# EAGLE design EasyFlash 1.4.1 REV B (EAGLE 5.05)
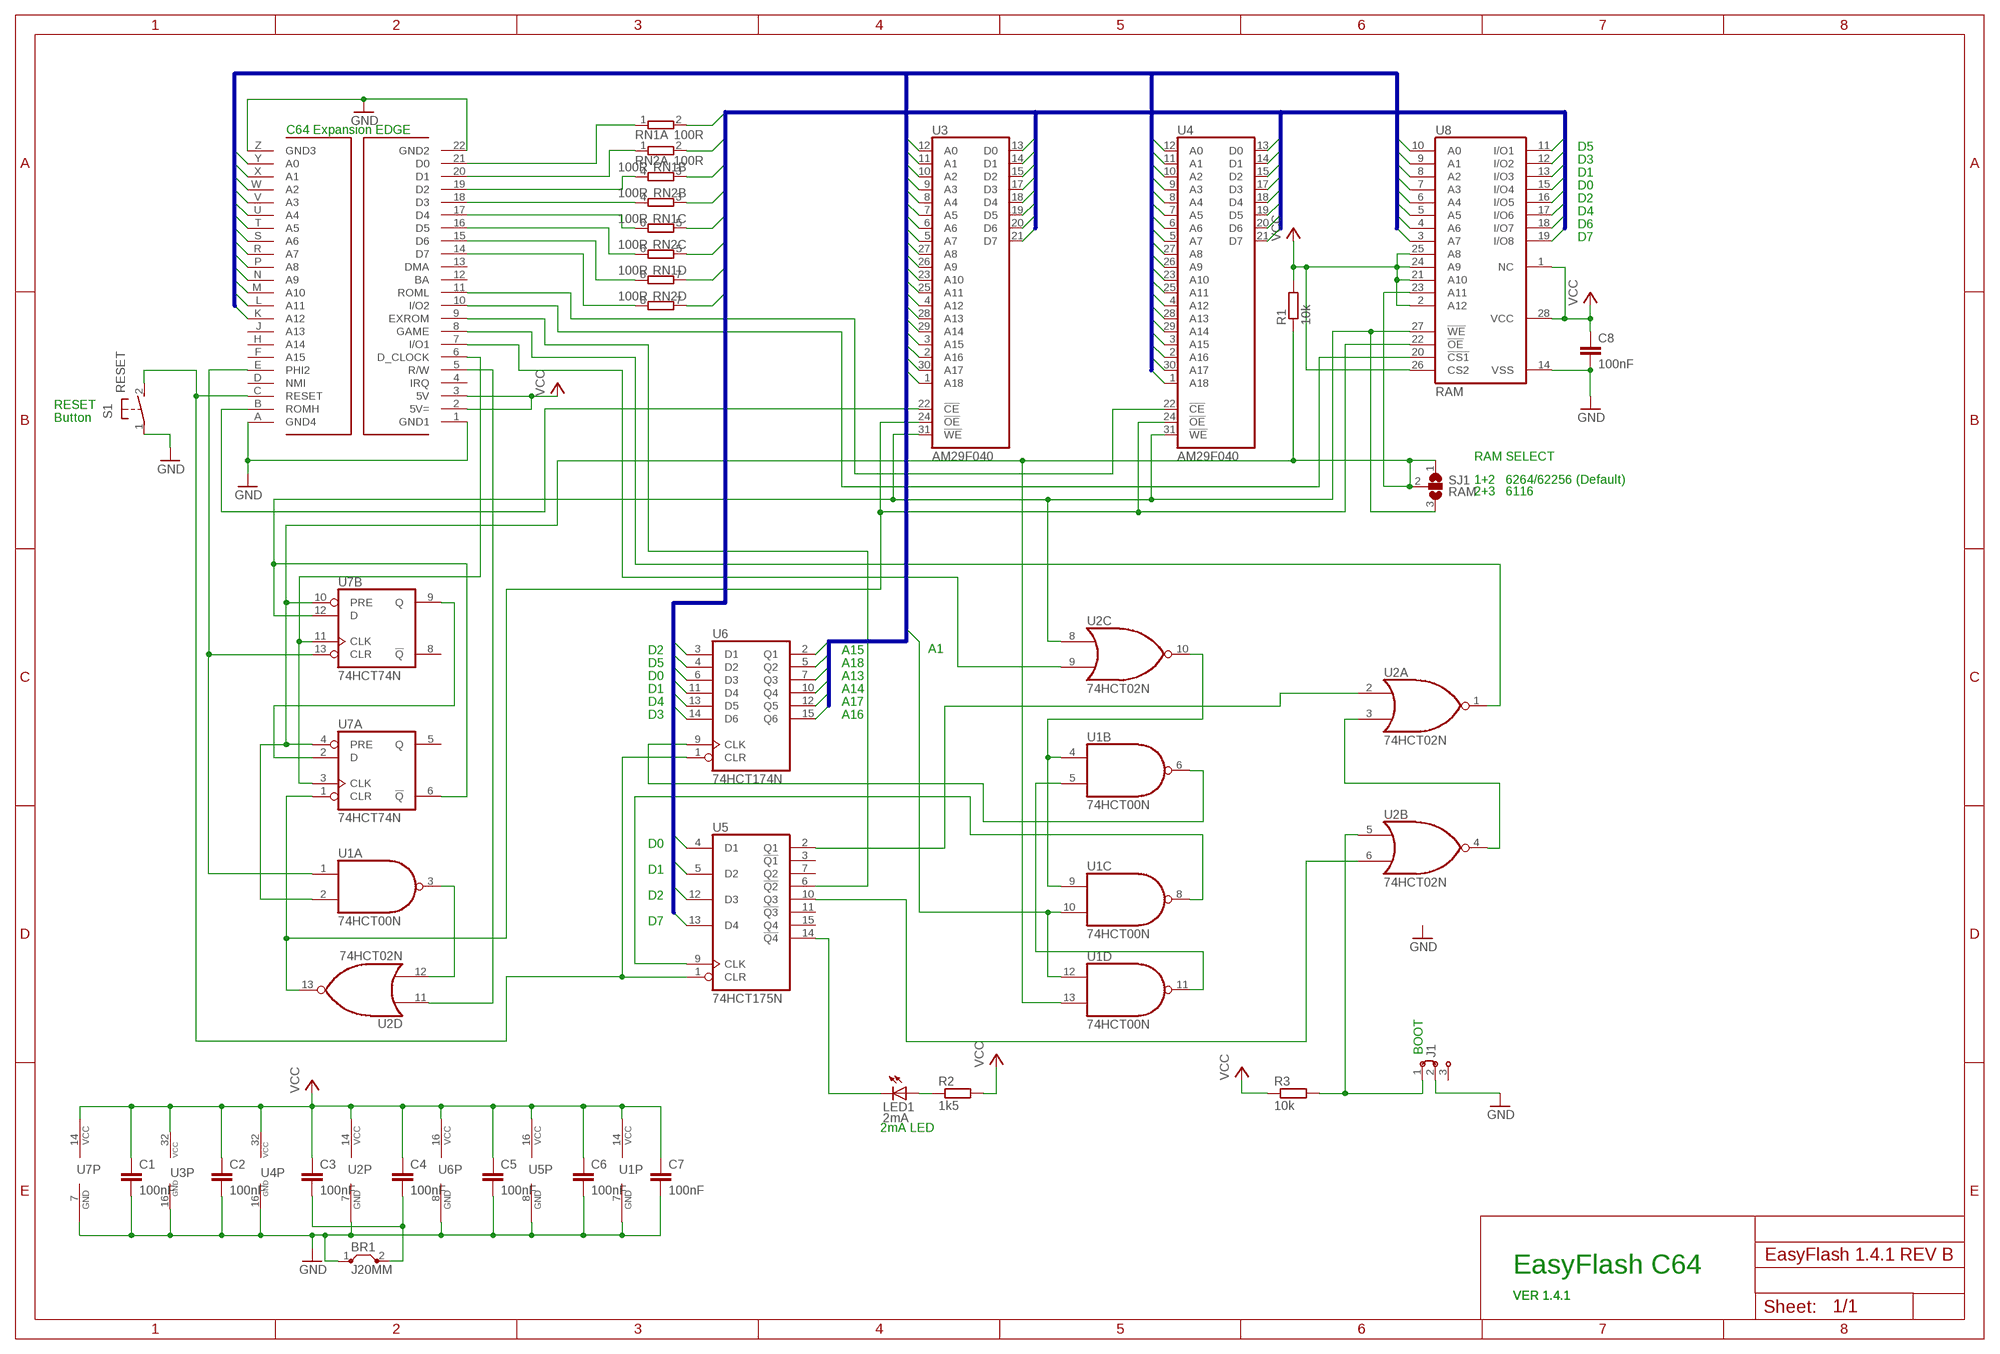
[diagram p0: schematic, sheet 1]

## Parts
BR1  J20MM  [20]
C1  100nF  C-EU050-025X075  [C050-025X075]
C2  100nF  C-EU050-025X075  [C050-025X075]
C3  100nF  C-EU050-025X075  [C050-025X075]
C4  100nF  C-EU050-025X075  [C050-025X075]
C5  100nF  C-EU050-025X075  [C050-025X075]
C6  100nF  C-EU050-025X075  [C050-025X075]
C7  100nF  C-EU050-025X075  [C050-025X075]
C8  100nF  C-EU050-025X075  [C050-025X075]
CN1  EP64  CARTRIDGE  [CARTRIDGE]
J1  J2X3MM  [03C]
LED1  2mA  LED3MM  [LED3MM]
R1  10k  R-EU_0207/10  [0207/10]
R2  1k5  R-EU_0207/10  [0207/10]
R3  10k  R-EU_0207/10  [0207/10]
RN1  100R  E4R  [SIL8]
RN2  100R  E4R  [SIL8]
S1  RESET  31-XX  [B3F-31XX]
SJ1  RAM  SJ2WW  [SJ_2W]
U1  74HCT00N  74LS00N  [DIL14]
U2  74HCT02N  74LS02N  [DIL14]
U3  AM29F040  AM29F040JPLCC_DIL  [PLCC-SR32]
U4  AM29F040  AM29F040JPLCC_DIL  [PLCC-SR32]
U5  74HCT175N  74LS175N  [DIL16]
U6  74HCT174N  74LS174N  [DIL16]
U7  74HCT74N  74LS74N  [DIL14]
U8  RAM  6264A  [DIL28-6]

## Nets
/OE: U2.13(D:O) U3.24(!OE) U4.24(!OE) U7.1(A:CLR) U8.22(!OE)
/WE: SJ1.3 U2.8(C:I0) U3.31(!WE) U4.31(!WE) U7.6(A:!Q) U7.12(B:D) U8.27(!WE)
A0: CN1.Y(A0) U3.12(A0) U4.12(A0) U8.10(A0)
A1: CN1.X(A1) U1.10(C:I1) U1.12(D:I0) U3.11(A1) U4.11(A1) U8.9(A1)
A2: CN1.W(A2) U3.10(A2) U4.10(A2) U8.8(A2)
A3: CN1.V(A3) U3.9(A3) U4.9(A3) U8.7(A3)
A4: CN1.U(A4) U3.8(A4) U4.8(A4) U8.6(A4)
A5: CN1.T(A5) U3.7(A5) U4.7(A5) U8.5(A5)
A6: CN1.S(A6) U3.6(A6) U4.6(A6) U8.4(A6)
A7: CN1.R(A7) U3.5(A7) U4.5(A7) U8.3(A7)
A8: CN1.P(A8) U3.27(A8) U4.27(A8)
A9: CN1.N(A9) U3.26(A9) U4.26(A9)
A10: CN1.M(A10) U3.23(A10) U4.23(A10)
A11: CN1.L(A11) U3.25(A11) U4.25(A11)
A12: CN1.K(A12) U3.4(A12) U4.4(A12)
A13: U3.28(A13) U4.28(A13) U6.7(Q3)
A14: U3.29(A14) U4.29(A14) U6.10(Q4)
A15: U3.3(A15) U4.3(A15) U6.2(Q1)
A16: U3.2(A16) U4.2(A16) U6.15(Q6)
A17: U3.30(A17) U4.30(A17) U6.12(Q5)
A18: U3.1(A18) U4.1(A18) U6.5(Q2)
D0: RN1.2 U3.13(D0) U4.13(D0) U5.4(D1) U6.6(D3) U8.15(I/O4)
D1: RN2.2 U3.14(D1) U4.14(D1) U5.5(D2) U6.11(D4) U8.13(I/O3)
D2: RN1.3 U3.15(D2) U4.15(D2) U5.12(D3) U6.3(D1) U8.16(I/O5)
D3: RN2.3 U3.17(D3) U4.17(D3) U6.14(D6) U8.12(I/O2)
D4: RN1.5 U3.18(D4) U4.18(D4) U6.13(D5) U8.17(I/O6)
D5: RN2.5 U3.19(D5) U4.19(D5) U6.4(D2) U8.11(I/O1)
D6: RN1.7 U3.20(D6) U4.20(D6) U8.18(I/O7)
D7: RN2.7 U3.21(D7) U4.21(D7) U5.13(D4) U8.19(I/O8)
DOTCLK: CN1.6(D_CLOCK) U7.3(A:CLK) U7.11(B:CLK)
EXROM: CN1.9(EXROM) U5.6(!Q2)
GAME: CN1.8(GAME) U2.1(A:O)
GND: BR1.1 C1.2 C2.2 C5.2 C6.2 C7.2 C8.2 CN1.1(GND1) CN1.22(GND2) CN1.A(GND4) CN1.Z(GND3) J1.2 S1.1(P) U1.7(P:GND) U2.7(P:GND) U3.16(GND) U4.16(GND) U5.8(GND) U6.8(GND) U7.7(P:GND) U8.14(VSS)
I/O1: CN1.7(I/O1) U2.9(C:I1)
I/O2: CN1.10(I/O2) U8.20(!CS1)
N$1: U2.3(A:I1) U2.4(B:O)
N$2: CN1.21(D0) RN1.1
N$3: CN1.20(D1) RN2.1
N$4: CN1.19(D2) RN1.4
N$5: CN1.18(D3) RN2.4
N$6: CN1.17(D4) RN1.6
N$7: CN1.16(D5) RN2.6
N$8: CN1.15(D6) RN1.8
N$9: CN1.14(D7) RN2.8
N$11: U1.4(B:I0) U1.9(C:I0) U2.10(C:O)
N$14: U7.2(A:D) U7.9(B:Q)
N$15: U1.5(B:I1) U1.11(D:O)
N$16: LED1.A R2.1
N$17: J1.1 R3.2 U2.5(B:I0)
N$18: LED1.K(C) U5.14(!Q4)
N$21: U1.3(A:O) U2.12(D:I1)
N$30: U1.6(B:O) U6.9(CLK)
N$31: U1.8(C:O) U5.9(CLK)
N$32: U2.2(A:I0) U5.2(Q1)
N$33: U2.6(B:I1) U5.10(Q3)
N$34: BR1.2 C3.2 C4.2
PHI2: CN1.E(PHI2) U1.1(A:I0) U7.13(B:CLR)
PULLUP: R1.1 SJ1.1 SJ1.2 U1.2(A:I1) U1.13(D:I1) U7.4(A:PRE) U7.10(B:PRE) U8.23(A11)
R/W: CN1.5(R/W) U2.11(D:I0)
RESET: CN1.C(RESET) S1.2(S) U5.1(CLR) U6.1(CLR)
ROMH: CN1.B(ROMH) U3.22(!CE)
ROML: CN1.11(ROML) U4.22(!CE)
VCC: C1.1 C2.1 C3.1 C4.1 C5.1 C6.1 C7.1 C8.1 CN1.2(5V=) CN1.3(5V) R1.2 R2.2 R3.1 U1.14(P:VCC) U2.14(P:VCC) U3.32(VCC) U4.32(VCC) U5.16(VCC) U6.16(VCC) U7.14(P:VCC) U8.1(NC) U8.2(A12) U8.21(A10) U8.24(A9) U8.25(A8) U8.26(CS2) U8.28(VCC)
Unconnected: CN1.4(IRQ) CN1.12(BA) CN1.13(DMA) CN1.D(NMI) CN1.F(A15) CN1.H(A14) CN1.J(A13) J1.3 U5.3(!Q1) U5.7(Q2) U5.11(!Q3) U5.15(Q4) U7.5(A:Q) U7.8(B:!Q)

## Buses
D[0..7]
A[0..18]

## Notes on the sheet
- C64 Expansion EDGE
- D5
- D3
- D1
- D0
- D2
- D4
- D6
- D7
- RESET
- Button
- RAM SELECT
- 1+2   6264/62256 (Default)
- 2+3   6116
- D2 | A15 | A1
- D5 | A18
- D0 | A13
- D1 | A14
- D4 | A17
- D3 | A16
- D0
- D1
- D2
- D7
- BOOT
- 2mA LED
- EasyFlash C64
- VER 1.4.1 | VER 1.4.1

## Library data of the parts
BR1 = jumper:J: Bridge
C1-C8 = rcl:C-EU: CAPACITOR, European symbol
CN1 = C64_EXPANSION_:CARTRIDGE
J1 = jumper:J2: Jumper switch 2 x 2.5 mm
LED1 = led:LED: LED OSRAM: - CHIPLED LG R971, LG N971, LY N971, LG Q971, LY Q971, LO R971, LY R971 LH N974, LH R974 LS Q976, LO Q976, LY Q976 LO Q996 - Hyper CHIPLED LW Q18S LB Q993, LB Q99A, LB R99A - SideLED LS A670, LO A670, LY A670, LG A670, LP A670 LB A673, LV A673, LT A673, LW A673 LH A674 LY A675 LS A676, LA A676, LO A676, LY A676, LW A676 LS A679, LY A679, LG A679 - Hyper Micro SIDELED® LS Y876, LA Y876, LO Y876, LY Y876 LT Y87S - SmartLED LW L88C, LW L88S LB L89C, LB L89S, LG L890 LS L89K, LO L89K, LY L89K LS L896, LA L896, LO L896, LY L896 - TOPLED LS T670, LO T670, LY T670, LG T670, LP T670 LSG T670, LSP T670, LSY T670, LOP T670, LYG T670 LG T671, LOG T671, LSG T671 LB T673, LV T673, LT T673, LW T673 LH T674 LS T676, LA T676, LO T676, LY T676, LB T676, LH T676, LSB T676, LW T676 LB T67C, LV T67C, LT T67C, LS T67K, LO T67K, LY T67K, LW E67C LS E67B, LA E67B, LO E67B, LY E67B, LB E67C, LV E67C, LT E67C LW T67C LS T679, LY T679, LG T679 LS T770, LO T770, LY T770, LG T770, LP T770 LB T773, LV T773, LT T773, LW T773 LH T774 LS E675, LA E675, LY E675, LS T675 LS T776, LA T776, LO T776, LY T776, LB T776 LHGB T686 LT T68C, LB T68C - Hyper Mini TOPLED® LB M676 - Mini TOPLED Santana® LG M470 LS M47K, LO M47K, LY M47K Source: http://www.osram.convergy.de LUXEON: - LUMILED® LXK2-PW12-R00, LXK2-PW12-S00, LXK2-PW14-U00, LXK2-PW14-V00 LXK2-PM12-R00, LXK2-PM12-S00, LXK2-PM14-U00 LXK2-PE12-Q00, LXK2-PE12-R00, LXK2-PE12-S00, LXK2-PE14-T00, LXK2-PE14-U00 LXK2-PB12-K00, LXK2-PB12-L00, LXK2-PB12-M00, LXK2-PB14-N00, LXK2-PB14-P00, LXK2-PB14-Q00 LXK2-PR12-L00, LXK2-PR12-M00, LXK2-PR14-Q00, LXK2-PR14-R00 LXK2-PD12-Q00, LXK2-PD12-R00, LXK2-PD12-S00 LXK2-PH12-R00, LXK2-PH12-S00 LXK2-PL12-P00, LXK2-PL12-Q00, LXK2-PL12-R00 Source: www.luxeon.com KINGBRIGHT: KA-3528ASYC Source: www.kingbright.com
R1-R3 = rcl:R-EU_: RESISTOR, European symbol
RN1 RN2 = resistor-sil:E4R: SIL RESISTOR
S1 = switch-omron:31-XX: OMRON SWITCH
SJ1 = jumper:SJ2W: SMD solder JUMPER
U1 = 74xx-us:74*00: Quad 2-input NAND gate
U2 = 74xx-us:74*02: Quad 2-input NOR gate
U3 U4 = am29-memory:AM29F040J: 4-Megabit FLASH MEMORY (512 K x 8 bit) 5 V-only
U5 = 74xx-us:74*175: Qadruple D type FLIP FLOP, clear
U6 = 74xx-us:74*174: Hex D type FLIP FLOP, clear
U7 = 74xx-us:74*74: Dual D type positive edge triggered FLIP FLOP, preset and clear
U8 = memory-hitachi:6264A: MEMORY

## Board
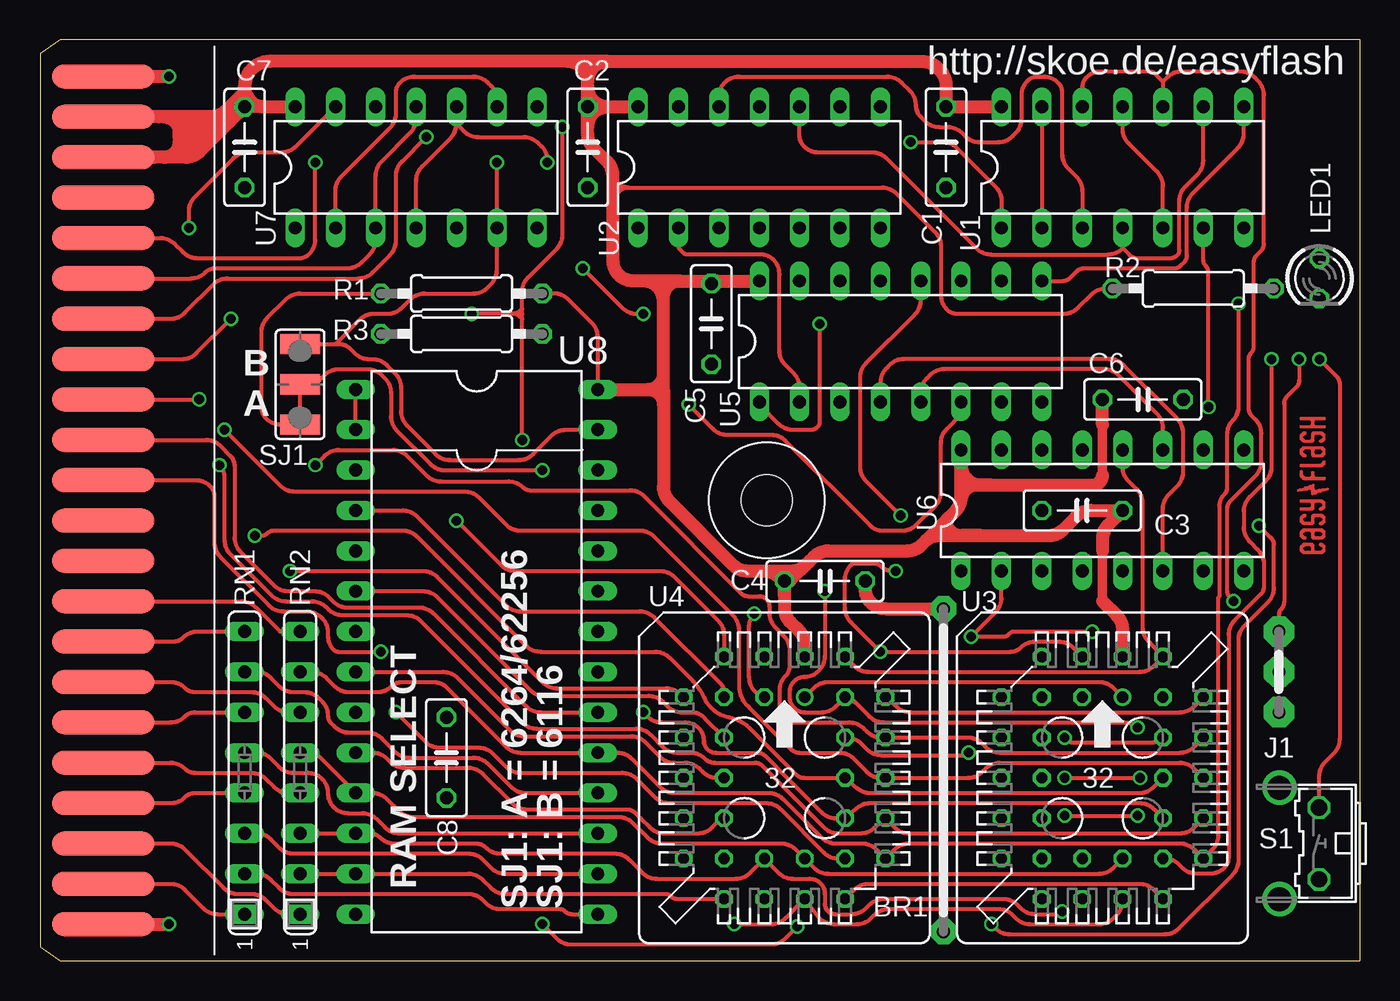
[diagram p1: board, top side]
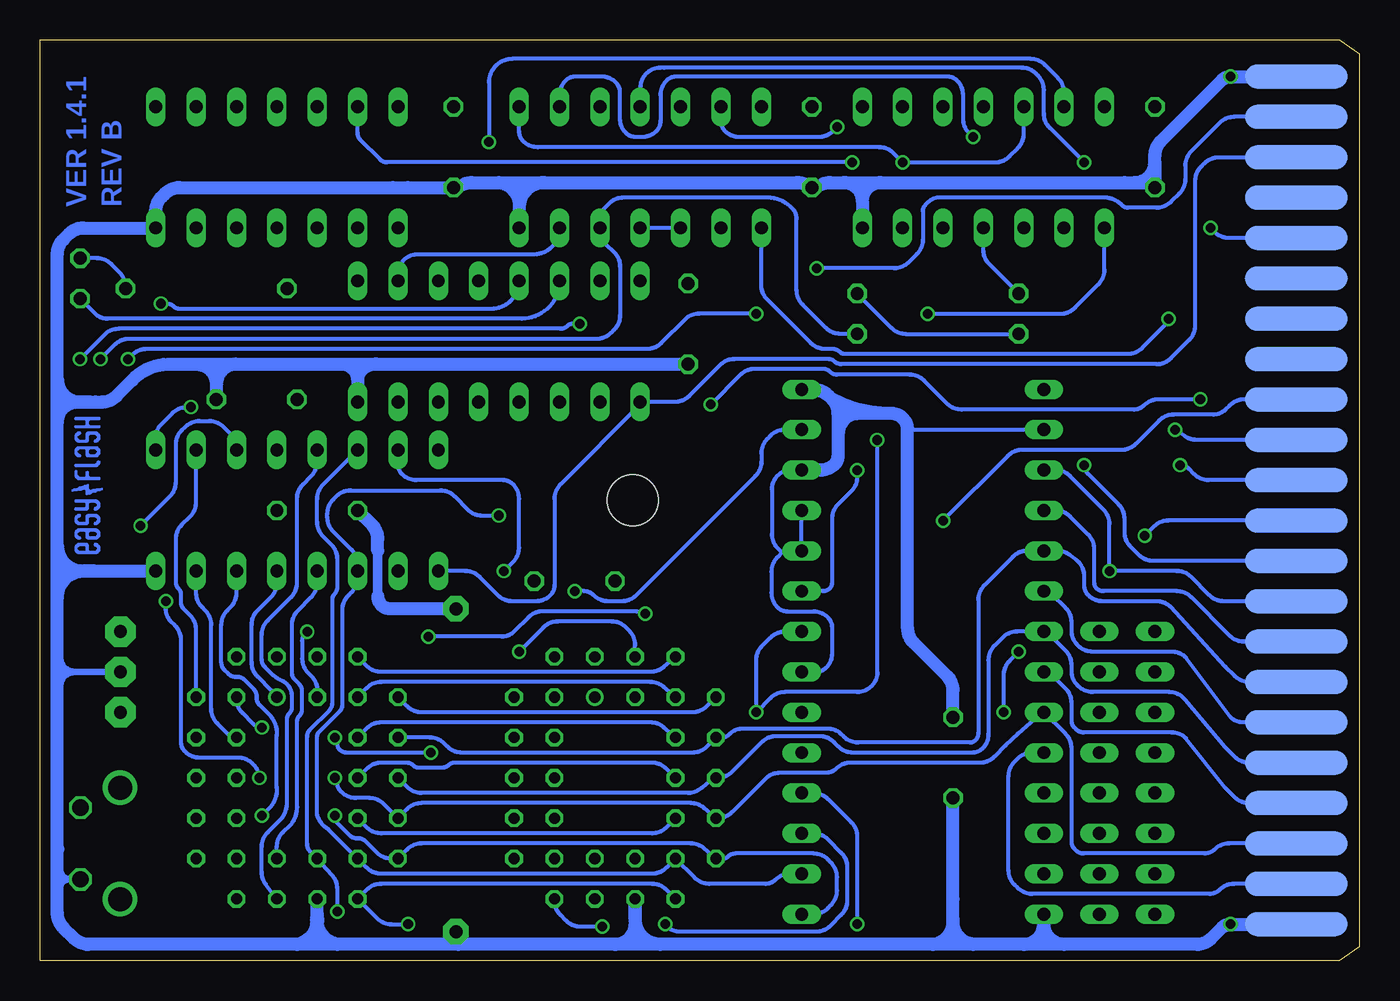
[diagram p2: board, bottom side, seen from below]

Size 83.03 x 57.98 mm. Coordinates in mm from the lower left corner, seen from the top.
Copper layers (1*16): Top 0.035mm / dielectric 1.5mm / Bottom 0.035mm
Design rules "PCB-POOL": minimum track width 6mil, minimum drill 12mil, track to track 6mil, track to pad 6mil, pad to pad 6mil, via to via 6mil, smd to smd 6mil, copper to edge 20mil, drill to drill 8mil, minimum pad ring 8mil, minimum via ring 6mil, stop-mask expansion 3mil, vias tented up to drill 0mil, thermal gap 8mil

### Footprints (pad centres in the part's own frame; a part is rotated, then mirrored left to right if it is on the bottom)
20 = drill 0.813 pad 1.6 octagon: 1 -10.16,0; 2 10.16,0
C050-025X075 = drill 0.813 octagon: 1 -2.54,0; 2 2.54,0
CARTRIDGE = smd 1.524 x 6.477: 1 -52.07,-24.13; 2 -49.53,-24.13; 3 -46.99,-24.13; 4 -44.45,-24.13; 5 -41.91,-24.13; 6 -39.37,-24.13; 7 -36.83,-24.13; 8 -34.29,-24.13; 9 -31.75,-24.13; 10 -29.21,-24.13; 11 -26.67,-24.13; 12 -24.13,-24.13; 13 -21.59,-24.13; 14 -19.05,-24.13; 15 -16.51,-24.13; 16 -13.97,-24.13; 17 -11.43,-24.13; 18 -8.89,-24.13; 19 -6.35,-24.13; 20 -3.81,-24.13; 21 -1.27,-24.13; 22 1.27,-24.13 | smd 1.524 x 6.477 bottom: A -52.07,-24.13; B -49.53,-24.13; C -46.99,-24.13; D -44.45,-24.13; E -41.91,-24.13; F -39.37,-24.13; H -36.83,-24.13; J -34.29,-24.13; K -31.75,-24.13; L -29.21,-24.13; M -26.67,-24.13; N -24.13,-24.13; P -21.59,-24.13; R -19.05,-24.13; S -16.51,-24.13; T -13.97,-24.13; U -11.43,-24.13; V -8.89,-24.13; W -6.35,-24.13; X -3.81,-24.13; Y -1.27,-24.13; Z 1.27,-24.13 | hole 3.2: -25.4,17.621
03C = drill 0.813 pad 1.905 octagon: 1 0,0; 2 2.54,0; 3 5.08,0
LED3MM = drill 0.813 octagon: A -1.27,0; K 1.27,0
0207/10 = drill 0.813 octagon: 1 -5.08,0; 2 5.08,0
SIL8 = drill 0.813 long: 1 -8.89,0; 2 -6.35,0; 3 -3.81,0; 4 -1.27,0; 5 1.27,0; 6 3.81,0; 7 6.35,0; 8 8.89,0
B3F-31XX = drill 1.016 octagon: 1 -2.261,-1.245; 2 2.261,-1.245 | drill 1.499 pad 2.159 round: 3 -3.505,1.245; 4 3.505,1.245
SJ_2W = smd 1.27 x 2.54: 1 -2.54,0; 2 0,0; 3 2.54,0
DIL14 = drill 0.813 long: 1 -7.62,-3.81; 2 -5.08,-3.81; 3 -2.54,-3.81; 4 0,-3.81; 5 2.54,-3.81; 6 5.08,-3.81; 7 7.62,-3.81; 8 7.62,3.81; 9 5.08,3.81; 10 2.54,3.81; 11 0,3.81; 12 -2.54,3.81; 13 -5.08,3.81; 14 -7.62,3.81
PLCC-SR32 = drill 0.7 pad 1.016 round: 1 1.27,5.08 | drill 0.7 pad 1.016 octagon: 2 -1.27,7.62; 3 -1.27,5.08; 4 -3.81,7.62; 5 -6.35,5.08; 6 -3.81,5.08; 7 -6.35,2.54; 8 -3.81,2.54; 9 -6.35,0; 10 -3.81,0; 11 -6.35,-2.54; 12 -3.81,-2.54; 13 -6.35,-5.08; 14 -3.81,-7.62; 15 -3.81,-5.08; 16 -1.27,-7.62; 17 -1.27,-5.08; 18 1.27,-7.62; 19 1.27,-5.08; 20 3.81,-7.62; 21 6.35,-5.08; 22 3.81,-5.08; 23 6.35,-2.54; 24 3.81,-2.54; 25 6.35,0; 26 3.81,0; 27 6.35,2.54; 28 3.81,2.54; 29 6.35,5.08; 30 3.81,7.62; 31 3.81,5.08; 32 1.27,7.62
DIL16 = drill 0.813 long: 1 -8.89,-3.81; 2 -6.35,-3.81; 3 -3.81,-3.81; 4 -1.27,-3.81; 5 1.27,-3.81; 6 3.81,-3.81; 7 6.35,-3.81; 8 8.89,-3.81; 9 8.89,3.81; 10 6.35,3.81; 11 3.81,3.81; 12 1.27,3.81; 13 -1.27,3.81; 14 -3.81,3.81; 15 -6.35,3.81; 16 -8.89,3.81
DIL28-6 = drill 0.813 long: 1 -16.51,-7.62; 2 -13.97,-7.62; 3 -11.43,-7.62; 4 -8.89,-7.62; 5 -6.35,-7.62; 6 -3.81,-7.62; 7 -1.27,-7.62; 8 1.27,-7.62; 9 3.81,-7.62; 10 6.35,-7.62; 11 8.89,-7.62; 12 11.43,-7.62; 13 13.97,-7.62; 14 16.51,-7.62; 15 16.51,7.62; 16 13.97,7.62; 17 11.43,7.62; 18 8.89,7.62; 19 6.35,7.62; 20 3.81,7.62; 21 1.27,7.62; 22 -1.27,7.62; 23 -3.81,7.62; 24 -6.35,7.62; 25 -8.89,7.62; 26 -11.43,7.62; 27 -13.97,7.62; 28 -16.51,7.62

### Placement (x,y rotation side)
BR1  56.83,12 90 top
C1  56.99,51.21 270 top
C2  34.45,51.21 270 top
C3  65.56,28.35 180 top
C4  49.37,23.91 0 top
C5  42.23,40.1 270 top
C6  69.37,35.34 0 top
C7  12.86,51.21 270 top
C8  25.56,12.8 270 top
CN1  28.1,3.59 270 top
J1  77.95,20.73 270 top
LED1  80.49,42.96 270 top
R1  26.51,42.01 0 top
R2  72.55,42.32 180 top
R3  26.51,39.47 0 top
RN1  12.86,11.84 90 top
RN2  16.35,11.84 90 top
S1  79.22,7.4 90 top
SJ1  16.35,36.29 90 top
U1  68.1,49.94 0 top
U2  45.24,49.94 0 top
U3  66.83,11.53 0 top
U4  46.83,11.53 0 top
U5  54.13,38.99 0 top
U6  66.83,28.35 0 top
U7  23.65,49.94 0 top
U8  27.46,19.46 270 top

### Tracks (layer width: path | path; a pad name or v marks a point on that pad's centre or on a via)
/OE  (via drill 0.6)
  Top 0.254: U3.24 70.06,9.57 arc45 69.16,9.94 52.22,9.94 arc41 51.4,9.63 U4.24 50.06,8.98 arc-45 49.16,9.36 47.04,11.47 45.59,12.93 arc45 45.14,13.11 42.5,13.11 arc-90 41.75,13.86 arc90 40.59,15.02 39.1,15.02 arc-45 38.2,15.39 v37.94,15.65 | v30.32,32.78 30.32,40.42 | 30.32,40.42 30.32,40.74 | 30.32,40.74 30.32,41.05 | 30.32,41.05 30.32,42.11 arc-45 30.69,43.01 32.49,44.81 arc45 32.86,45.71 v32.86,52.48 | 30.32,40.74 29.69,40.74 | 29.69,40.74 v27.15,40.74 | 29.74,40.74 arc-45 30.19,40.55 30.32,40.42 | 29.74,40.74 29.69,40.74 | 29.74,40.74 arc45 30.19,40.92 30.32,41.05
  Bottom 0.254: U8.22 36.14,20.73 arc-45 37.04,20.36 37.57,19.83 arc-45 37.94,18.94 v37.94,15.65 37.04,16.55 arc45 36.14,16.92 31.59,16.92 arc-90 30.32,18.19 v30.32,32.78 | v32.86,52.48 33.12,52.22 arc45 34.02,51.85 39,51.85 arc45 39.9,52.22 arc45 40.16,52.85 U2.13 | U7.1 16.03,43.48 arc45 16.41,42.59 17.88,41.11 arc45 18.78,40.74 v27.15,40.74
/WE  (via drill 0.6)
  Top 0.254: v69.06,14.7 68.9,14.8 arc34 68.2,15.02 53.07,15.02 arc-45 52.17,15.39 51.34,16.22 arc45 50.8,16.45 U4.31 50.06,16.02 arc-45 49.16,15.65 48.1,15.65 arc-90 47.15,16.61 47.15,16.92 arc-90 48.1,17.88 arc50 49,18.3 arc45 49.37,19.19 v49.37,23.27 | U8.27 33.07,33.43 arc45 32.17,33.06 31.01,31.9 arc-45 30.11,31.53 25.77,31.53 arc-45 24.87,31.9 23.07,33.7 arc-45 22.7,34.59 22.7,36.08 arc45 22.33,36.98 21.8,37.51 arc45 20.9,37.88 20.69,37.88 arc-45 19.79,38.25 19.53,38.51 arc45 18.76,38.83 18.57,38.83 | SJ1.3 18.57,38.83 | 18.57,38.83 20.11,40.36 arc-45 21,40.74 21.86,40.74 arc45 22.76,41.11 23.28,41.63 arc-45 24.18,42 27.25,42 arc45 28.15,42.38 28.36,42.59 arc45 28.73,43.48 U7.6 v28.73,50.26 arc44 v28.73,50.26
  Bottom 0.254: v69.06,14.7 arc45 69.6,14.92 70.27,15.6 arc45 70.64,16.5 U3.31 | U8.27 36.14,33.43 arc-45 37.04,33.06 37.25,32.85 arc-45 37.62,31.95 37.62,31.42 arc45 38,30.52 45.51,23.01 arc45 46.4,22.64 47.26,22.64 arc45 48.16,23.01 arc-45 48.79,23.27 v49.37,23.27 | U2.8 52.86,52.22 arc-45 52.6,51.58 arc-45 51.7,51.21 30.21,51.21 arc45 29.31,50.84 v28.73,50.26 22.91,50.26 arc-45 22.01,50.63 21.49,51.16 arc-45 21.11,52.06 U7.12
A0
  Top 0.254: U4.12 arc45 42.75,8.87 42.28,8.4 arc-45 41.38,8.03 39.26,8.03 arc-45 38.36,8.4 37.78,8.98 37.46,9.3 arc45 36.89,9.54 30.61,9.54 arc-45 29.71,9.91 27.84,11.79 arc45 26.94,12.16 22.91,12.16 arc-45 22.01,12.53 21.8,12.74 arc45 20.9,13.11 U8.10
  Bottom 0.152: 43.34,8.67
  Bottom 0.254: U3.12 62.44,8.4 arc-45 61.54,8.03 44.5,8.03 arc-45 43.6,8.4 43.34,8.67 U4.12 | CN1.Y 7.89,4.86 arc-45 8.79,4.49 arc45 9.42,4.22 20.59,4.22 arc45 21.49,4.59 21.69,4.8 arc45 22.07,5.7 22.07,11.63 arc45 21.69,12.53 21.49,12.74 arc45 20.59,13.11 U8.10
A1  (via drill 0.6)
  Top 0.254: v64.45,11.53 v69.21,11.53 | v75.09,22.64 74.88,22.85 arc-45 74.69,23.3 74.69,28.49 arc-45 74.88,28.94 75.46,29.52 75.88,29.94 76.46,30.52 arc45 76.83,31.42 76.83,33.19 arc52 76.36,34.17 76.23,34.3 arc-45 76.04,34.75 76.04,37.89 arc-45 76.2,38.27 arc45 76.36,38.66 76.36,43.96 arc-45 76.54,44.41 76.81,44.68 arc45 76.99,45.13 76.99,54.5 arc45 76.62,55.39 76.41,55.6 arc45 75.51,55.97 71.8,55.97 arc45 70.91,55.6 70.64,55.34 | 70.64,55.34 U1.10 | 70.64,55.34 70.19,55.79 arc45 69.75,55.97 66.72,55.97 arc45 65.83,55.6 arc45 65.56,54.97 U1.12
  Bottom 0.254: CN1.X 8.2,7.4 arc-45 9.1,7.03 arc45 9.74,6.76 17.36,6.76 arc45 17.81,6.95 17.91,7.05 arc45 18.1,7.5 18.1,13.38 arc-45 18.47,14.28 U8.9 arc-8 22.25,13.56 22.96,12.85 arc45 23.86,12.48 32.02,12.48 arc-45 32.92,12.11 arc45 33.55,11.84 36.46,11.84 arc-45 37.36,11.47 39.47,9.36 arc45 40.37,8.98 U4.11 41.24,9.63 arc-41 42.06,9.94 59,9.94 arc-45 59.9,9.57 U3.11 61.38,9.88 arc-45 62.28,10.25 63.13,10.25 arc45 64.03,10.63 64.11,10.7 arc45 64.29,11.15 arc-45 v64.44,11.52 v64.45,11.53 | v69.21,11.53 arc-45 69.55,12.34 69.64,12.42 arc-45 70.53,12.8 72.97,12.8 arc45 73.87,13.17 arc45 74.14,13.8 74.14,20.21 arc-45 74.51,21.1 74.77,21.37 arc45 75.09,22.13 v75.09,22.64
A2
  Top 0.254: U4.10 42.59,11.53 arc-45 41.7,11.9 41.49,12.11 arc45 40.59,12.48 39.9,12.48 arc-45 39,12.85 38.07,13.77 arc45 37.18,14.14 30.45,14.14 arc-45 29.55,14.52 26.25,17.82 arc45 25.35,18.19 U8.8
  Bottom 0.254: U4.10 43.6,12.11 arc-45 44.5,12.48 56.96,12.48 arc-45 57.28,12.35 arc45 57.73,12.16 59.19,12.16 arc45 59.5,12.29 arc-45 59.95,12.48 61.54,12.48 arc-45 62.44,12.11 U3.10 | U8.8 arc45 19.3,17.97 18.47,17.14 arc45 18.1,16.24 18.1,15.12 arc-45 17.91,14.67 17.81,14.57 arc-45 17.36,14.38 11.8,14.38 arc45 10.9,14.01 8.41,10.89 7.83,10.31 arc-45 6.93,9.94 CN1.W
A3
  Bottom 0.254: U3.9 59.9,10.94 arc-45 59,10.57 42.22,10.57 arc-41 41.39,10.88 40.76,11.42 arc41 U4.9 40.37,11.53 arc-45 39.47,11.9 37.6,13.77 arc45 36.7,14.14 33.94,14.14 arc45 33.04,13.77 32.76,13.48 arc-45 31.86,13.11 24.34,13.11 arc-45 23.71,13.38 arc-45 23.34,14.27 23.34,18.94 arc45 22.96,19.83 22.44,20.36 arc45 21.54,20.73 U8.7 arc45 19.57,20.62 18.47,19.52 arc45 18.1,18.62 18.1,18.24 arc-45 17.73,17.34 17.68,17.29 arc-45 16.78,16.92 11.96,16.92 arc45 11.06,16.55 10.95,16.45 8.41,13.43 7.83,12.85 arc-45 6.93,12.48 CN1.V
A4
  Top 0.254: U8.6 24.08,23.27 arc-45 24.98,22.9 30.82,17.06 arc45 31.72,16.68 38.29,16.68 arc-45 39.19,16.31 39.47,16.02 arc45 40.37,15.65 40.91,15.65 arc-54 41.81,15.28 U4.8
  Bottom 0.254: U4.8 43.78,14.71 arc-41 44.6,15.02 61.54,15.02 arc-45 62.44,14.65 U3.8 | U8.6 arc45 19.3,23.05 18.47,22.22 arc45 18.1,21.32 18.1,20.78 arc-45 17.73,19.88 17.68,19.83 arc-45 16.78,19.46 11.8,19.46 arc45 10.9,19.09 8.1,15.33 arc-45 7.33,15.02 CN1.U
A5
  Bottom 0.152: U4.7
  Bottom 0.254: U3.7 58.47,14.06 arc45 57.57,13.69 57.36,13.48 arc-45 56.46,13.11 41.96,13.11 arc-45 41.06,13.48 U4.7 40.11,14.06 arc-45 39.66,14.25 arc45 38.76,14.62 33.47,14.62 arc45 32.57,14.25 32.44,14.12 arc-45 31.54,13.75 24.47,13.75 arc-45 24.16,13.88 arc-45 23.97,14.33 23.97,22.75 arc45 23.6,23.64 21.8,25.44 arc45 20.9,25.81 U8.5 19,25.81 arc37 18.23,25.56 17.81,25.24 arc53 17.3,24.23 17.3,23.64 arc-45 17.04,23.01 arc-45 16.14,22.64 12.75,22.64 arc45 11.85,22.27 8.41,18.51 7.83,17.93 arc-45 6.93,17.56 CN1.T
A6
  Top 0.254: U8.4 22.81,28.35 arc-45 23.71,27.98 29.31,22.37 arc45 30.21,22 37.73,22 arc-45 38.63,21.63 42.83,17.43 arc-45 43.02,16.98 U4.6
  Bottom 0.254: U4.6 43.78,17.25 arc-41 44.6,17.56 61.54,17.56 arc-45 62.44,17.19 U3.6 | U8.4 19.1,28.35 arc45 18.2,27.98 17.04,26.82 arc45 16.67,25.92 16.67,23.78 arc-45 16.54,23.46 arc-45 16.09,23.27 11.48,23.27 arc45 10.58,22.9 8.15,20.47 arc-45 7.25,20.1 CN1.S
A7  (via drill 0.6)
  Top 0.254: v15.72,24.54 24.08,24.54 arc-45 24.98,24.17 31.62,17.53 arc45 32.51,17.16 39.4,17.16 arc-45 40.3,16.79 U4.5
  Bottom 0.152: U4.5
  Bottom 0.254: U4.5 41.06,16.02 arc45 41.96,15.65 59,15.65 arc45 59.9,16.02 U3.5 | U8.3 19.1,30.89 arc45 18.2,30.52 16.09,28.41 arc45 15.72,27.51 v15.72,24.54 11.48,24.54 arc45 10.58,24.17 9.42,23.01 arc-45 8.52,22.64 CN1.R
A8  (via drill 0.6)
  Top 0.254: U3.27 72.6,13.48 arc-45 71.7,13.11 60.37,13.11 arc-45 59.48,13.48 59.27,13.69 arc45 58.37,14.06 U4.27 52.91,14.06 arc-45 52.02,14.44 51.81,14.65 arc45 50.91,15.02 49.69,15.02 | 44.13,23.11 | v17.3,31.21 17.88,31.79 arc-45 18.78,32.16 22.17,32.16 arc-45 23.07,31.79 24.31,30.55 arc45 25.21,30.18 29.48,30.18 arc-45 30.38,29.81 arc45 30.82,29.62 37.1,29.62 arc-45 38,29.25 44.13,23.11 | 44.13,23.11 arc45 44.52,22.95 45.24,22.95 arc-90 45.88,22.32 45.88,21.89 arc45 46.25,21 46.78,20.47 arc-45 47.15,19.57 47.15,18.56 arc-45 46.89,17.93 arc45 46.51,17.03 46.51,15.78 arc79 47.15,15.02 49.69,15.02 | 49.69,15.02 arc90 49.69,15.02
  Bottom 0.254: v17.3,31.21 arc-45 17.08,30.67 15.14,28.72 arc45 14.76,27.83 14.76,26.97 arc-45 14.39,26.08 13.87,25.55 arc-45 12.97,25.18 CN1.P
A9  (via drill 0.6)
  Top 0.152: U4.26
  Top 0.254: U3.26 70.06,10.94 arc-45 69.16,10.57 52.22,10.57 arc-41 51.4,10.88 U4.26 48.05,11.53 arc-45 47.6,11.71 44.61,14.7 arc31 43.34,15.33 arc-55 41.75,16.61 arc21 41.06,17.61 39.58,19.09 arc45 38.68,19.46 31.48,19.46 arc-45 30.58,19.83 23.71,26.71 arc45 22.81,27.08 14.71,27.08 arc45 14.26,26.9 arc-45 13.94,26.77 v13.49,26.77
  Bottom 0.254: CN1.N 12.01,27.72 arc-45 12.91,27.35 v13.49,26.77
A10  (via drill 0.6)
  Top 0.152: U4.23
  Top 0.254: U3.23 72.6,8.4 arc-45 71.7,8.03 54.66,8.03 arc-45 53.76,8.4 U4.23 52.43,8.34 arc-41 51.6,8.03 50.21,8.03 arc-45 49.32,8.4 46.89,10.84 45.43,12.29 arc45 44.98,12.48 42.44,12.48 arc-45 41.81,12.74 arc45 40.91,13.11 40.05,13.11 arc-45 39.16,13.48 38.39,14.25 arc45 37.49,14.62 31.24,14.62 arc-45 30.35,14.99 23.95,21.39 arc45 23.05,21.76 19.02,21.76 arc-45 18.12,22.14 17.99,22.27 arc45 17.09,22.64 15.45,22.64 arc-45 14.55,23.01 11.96,25.6 arc-45 11.59,26.5 11.59,30.44 arc45 v11.27,31.21
  Bottom 0.254: v11.27,31.21 arc45 10.73,30.99 10.37,30.63 arc-45 9.47,30.26 CN1.M
A11  (via drill 0.6)
  Top 0.254: U3.25 72.6,12.11 arc45 71.7,12.48 60.37,12.48 arc45 59.48,12.11 59.27,11.9 arc-45 58.37,11.53 57.63,11.53 56.83,11.53 U4.25 52.91,11.53 arc-45 52.02,11.9 51.17,12.74 arc45 50.27,13.11 47.73,13.11 arc-45 47.28,13.3 44.61,15.97 arc-51 43.97,17.29 43.97,20.52 arc45 43.6,21.74 38.63,26.71 arc45 37.73,27.08 30.21,27.08 arc-45 29.31,27.45 27.6,29.17 arc45 26.7,29.54 16,29.54 arc-45 15.11,29.92 v11.59,33.43
  Bottom 0.254: CN1.L 10.25,32.8 arc34 10.96,33.01 v11.59,33.43
A12  (via drill 0.6)
  Top 0.254: v26.19,27.72 27.15,26.76 29,24.91 arc45 29.89,24.54 39,24.54 arc-45 39.9,24.17 42.65,21.42 arc-45 43.02,20.52 U4.4
  Bottom 0.152: U4.4
  Bottom 0.254: U4.4 43.78,18.5 arc41 44.6,18.19 61.54,18.19 arc45 62.44,18.56 U3.4 | v26.19,27.72 22.12,31.79 arc45 21.22,32.16 14.97,32.16 arc-45 14.07,32.53 12.59,34.01 arc45 11.69,34.39 9.18,34.39 arc-45 8.41,34.7 8.15,34.97 arc45 7.25,35.34 CN1.K
A13  (via drill 0.6)
  Top 0.254: U4.28 50.75,14.06 arc-45 51.65,13.69 52.02,13.33 arc45 52.91,12.95 58.1,12.95 v58.42,13.11 | U3.28 arc-45 69.88,13.75 65.03,13.75 arc-45 64.58,13.93 v64.45,14.07
  Bottom 0.254: v58.42,13.11 | U3.28 arc45 71.19,14.29 71.86,14.96 arc45 72.23,15.86 72.23,21.16 arc-45 72.6,22.06 72.81,22.27 arc45 73.18,23.16 U6.7 | U6.7 | v58.42,13.11 63.71,13.11 arc45 64.16,13.3 arc45 64.29,13.62 64.29,13.68 arc-45 v64.45,14.07
A14
  Top 0.152: U4.29
  Top 0.254: U4.29 53.94,15.96 arc41 54.76,15.65 71.7,15.65 arc45 72.6,16.02 U3.29
  Bottom 0.254: U3.29 73.18,20.84 arc-45 73.56,21.74 73.95,22.13 arc45 74.14,22.58 74.14,23.09 arc-45 74.27,23.4 arc45 74.45,23.85 74.45,26.56 arc45 74.08,27.45 73.56,27.98 arc-45 73.18,28.88 U6.10 | U6.10
A15  (via drill 0.6)
  Top 0.254: v66.2,20.73 61.25,20.73 arc45 61.03,20.64 60.89,20.51 arc-45 60.67,20.41 v58.58,20.41 60.11,21.95 arc45 60.48,22.85 U6.2 | v44.93,21.84 arc45 44.61,21.08 44.61,17.88 arc74 U4.3
  Bottom 0.152: 53.18,20.73
  Bottom 0.254: v44.93,21.84 45.21,21.94 arc-18 45.61,22 51.39,22 arc-45 52.28,21.63 53.18,20.73 arc45 53.95,20.41 v58.58,20.41 | U3.3 65.56,17.03 arc-45 65.94,17.93 66.14,18.14 arc45 66.52,19.04 66.52,20.15 arc45 66.33,20.6 v66.2,20.73
A16  (via drill 0.6)
  Top 0.254: U3.2 64.98,19.73 arc45 64.08,20.1 62.6,20.1 arc45 61.7,19.73 arc-45 61.06,19.46 v52.86,19.46 51.01,21.31 arc-45 50.64,22.21 50.64,24.02 arc-45 51.01,24.91 arc-45 51.26,25.02 52.48,25.02 arc-45 52.86,24.86 52.86,24.86 arc45 53.63,24.54 v53.82,24.54
  Bottom 0.254: U4.2 45.56,19.89 arc-45 45.93,20.79 46.14,21 arc-45 47.04,21.37 50.43,21.37 arc-45 51.33,21 v52.86,19.46 | U6.15 60.48,31.26 arc-45 60.22,30.63 arc-45 59.32,30.26 53.87,30.26 arc45 53.24,29.99 arc45 52.86,29.1 52.86,26.02 arc45 53.24,25.12 v53.82,24.54
A17
  Top 0.152: U4.30
  Top 0.254: U4.30 51.22,18.56 arc45 52.12,18.19 69.17,18.19 arc45 70.06,18.56 U3.30 69.72,20.13 arc-43 69.37,21 69.37,28.78 arc45 69,29.68 68.48,30.2 arc-45 68.1,31.1 U6.12 | U6.12
A18
  Top 0.254: U4.1 48.68,17.19 arc-45 49.58,17.56 66.62,17.56 arc-45 67.52,17.19 U3.1
  Bottom 0.254: U3.1 68.42,17 69.32,17.9 arc45 69.69,18.8 69.69,21.16 arc45 69.32,22.06 68.48,22.9 arc-45 68.1,23.8 U6.5 | U6.5
D0  (via drill 0.6)
  Top 0.254: U8.15 33.44,2.95 arc-45 32.99,3.14 arc45 32.68,3.27 28.94,3.27 arc-45 28.04,3.64 27.84,3.85 arc45 26.94,4.22 15.92,4.22 arc-45 15.03,4.59 14.5,5.12 arc45 13.6,5.49 RN1.2 | v64.45,9.14 v69.06,9.14 | U5.4 52.86,36.4 arc-45 53.24,37.3 53.44,37.51 arc-45 54.34,37.88 67.26,37.88 arc-45 68.16,37.51 71.54,34.12 arc-45 71.91,33.22 71.91,30.78 arc-45 71.54,29.89 71.02,29.36 arc45 70.64,28.46 U6.6 | U6.6
  Bottom 0.254: U8.15 34.34,2.95 arc-45 33.44,3.32 33.23,3.53 arc-45 32.86,4.43 32.86,5.28 arc-45 33.23,6.18 33.44,6.39 arc-45 34.34,6.76 39.27,6.76 arc-45 39.71,6.58 arc45 40.03,6.45 U4.13 41.24,7.09 arc-41 42.06,7.4 59,7.4 arc-45 59.9,7.03 U3.13 60.91,6.45 arc45 61.81,6.82 62.52,7.53 arc-45 62.97,7.72 63.08,7.72 arc45 63.53,7.9 64.27,8.64 arc45 64.45,9.09 v64.45,9.14 | U6.6 70.64,23.16 arc45 71.02,22.27 71.22,22.06 arc-45 71.6,21.16 71.6,18.77 arc-45 71.41,18.32 71.15,18.06 arc-45 70.7,17.88 70.59,17.88 arc45 70.14,17.69 69.56,17.11 arc45 69.37,16.66 69.37,16.55 arc-45 69.19,16.1 68.48,15.39 arc45 68.1,14.17 68.1,10.94 arc45 68.48,9.72 v69.06,9.14
D1  (via drill 0.6)
  Top 0.254: U4.14 40.11,3.91 arc-45 39.66,4.09 arc45 39.34,4.22 29.26,4.22 arc-45 28.36,4.59 27.84,5.12 arc45 26.94,5.49 U8.13 RN2.2 | v59.85,2.32 60.11,2.05 arc45 61.01,1.68 70.75,1.68 arc45 71.65,2.05 75.03,5.44 arc45 75.41,6.34 75.41,20.21 arc-45 75.78,21.1 77.26,22.58 arc45 77.63,23.48 77.63,26.18 arc45 77.44,26.63 v76.68,27.4 | U6.11 70.64,33.54 arc45 70.27,34.44 67.84,36.87 arc45 66.94,37.24 56.88,37.24 arc45 55.98,36.87 55.78,36.66 arc45 55.4,35.76 U5.5 | U6.11
  Bottom 0.254: U4.14 43.6,4.49 arc-45 44.5,4.86 61.54,4.86 arc-45 62.44,4.49 U3.14 61.81,2.69 arc-45 60.91,2.32 v59.85,2.32 | v76.68,27.4 74.83,29.25 arc-45 74.45,30.15 74.45,32.51 arc45 74.08,33.41 73.87,33.62 arc45 72.97,33.99 72.36,33.99 arc45 71.46,33.62 71.02,33.17 arc45 70.64,32.27 U6.11
D2  (via drill 0.6)
  Top 0.254: U8.16 29.26,5.49 arc-45 28.36,5.86 27.84,6.39 arc45 26.94,6.76 15.92,6.76 arc-45 15.03,7.13 14.5,7.66 arc45 13.6,8.03 RN1.3 | v54.13,28.04 51.97,30.2 arc-45 51.59,31.1 51.59,36.72 arc-45 51.97,37.61 55.03,40.68 arc45 55.4,41.58 U5.12
  Bottom 0.152: U4.15
  Bottom 0.254: U4.15 43.6,5.86 arc45 44.5,5.49 61.54,5.49 arc45 62.44,5.86 U3.15 64.87,8.3 arc45 65.56,9.19 65.56,14.19 arc45 65.48,14.38 64.16,15.7 arc-45 63.98,16.15 63.98,22.11 arc45 63.6,23.01 63.4,23.22 arc-45 63.02,24.12 U6.3 | U8.16 35.83,5.49 arc-45 36.73,5.12 arc45 37.36,4.86 40.91,4.86 arc45 41.81,5.23 U4.15 | U6.3 | U6.3 63.02,24.97 arc-45 63.4,25.87 64.56,27.03 arc45 64.93,27.93 64.93,28.14 arc45 64.56,29.04 64.35,29.25 arc45 63.45,29.62 57.83,29.62 arc45 56.94,29.25 56.09,28.41 arc-45 55.19,28.04 v54.13,28.04
D3  (via drill 0.6)
  Top 0.254: v64.29,3.11 arc-45 63.91,2.95 62.6,2.95 arc-45 61.7,3.32 61.49,3.53 arc45 60.59,3.91 53.07,3.91 arc45 52.17,3.53 51.97,3.32 arc-40 51.07,2.95 50.01,2.95 arc-90 49.37,3.59 49.37,4.22 arc90 48.42,5.17 47.36,5.17 arc-45 46.46,5.55 U4.17 44.66,5.55 arc-45 43.76,5.17 38.78,5.17 arc-45 37.89,5.55 37.04,6.39 arc45 36.14,6.76 28.94,6.76 arc-45 28.04,7.13 arc45 27.41,7.4 22.27,7.4 arc-45 21.38,7.77 arc45 20.74,8.03 U8.12 RN2.3
  Bottom 0.254: v64.29,3.11 64.29,4.53 arc-42 64.61,5.38 U3.17 66.01,6.89 arc45 66.2,7.34 66.2,14.12 arc45 66.01,14.57 64.8,15.78 arc-45 64.61,16.23 64.61,22.77 arc45 64.48,23.09 arc-45 64.29,23.54 64.29,25.29 arc-45 64.67,26.18 65.19,26.71 arc45 65.56,27.61 65.56,29.1 arc45 65.19,29.99 U6.14 | U6.14
D4  (via drill 0.6)
  Top 0.254: v43.66,2.32 45.99,2.32 arc45 46.89,2.69 U4.18 49,2.69 arc45 50.21,2.32 51.38,2.32 arc45 52.28,2.69 52.49,2.9 arc-45 53.39,3.27 60.27,3.27 arc-45 61.17,2.9 61.38,2.69 arc45 62.28,2.32 66.62,2.32 arc45 67.52,2.69 67.73,2.9 arc45 68.1,3.8 U3.18 | RN1.5 13.6,13.11 arc-45 14.5,12.74 15.03,12.21 arc45 15.92,11.84 16.83,11.84 arc-90 18.1,10.57 arc90 19.37,9.3 20.27,9.3 arc-45 21.17,8.93 21.69,8.4 arc45 22.59,8.03 U8.17
  Bottom 0.254: U8.17 34.34,8.03 arc45 33.44,7.66 32.6,6.82 arc45 32.23,5.92 32.23,3.8 arc45 32.6,2.9 33.28,2.21 arc45 34.18,1.84 42.77,1.84 arc56 v43.66,2.32 | U3.18 68.8,4.84 arc37 69.06,5.6 69.06,7.19 arc45 68.68,8.09 67.84,8.93 arc-45 67.47,10.15 67.47,15.2 arc45 67.3,15.61 arc-45 67.15,15.97 67.15,16.66 arc-66 67.79,17.64 arc19 68.41,18.05 68.87,18.51 arc45 69.06,18.96 69.06,20.52 arc45 68.68,21.42 67.21,22.9 arc-45 66.83,23.8 66.83,29.1 arc45 66.46,29.99 65.94,30.52 arc-45 65.56,31.42 U6.13
D5
  Top 0.152: U4.19 | U4.19
  Top 0.254: U3.19 67.52,5.86 arc-45 66.62,5.49 49.58,5.49 arc-45 48.68,5.86 U4.19 47.52,7.03 arc45 46.62,7.4 39.1,7.4 arc-45 38.2,7.77 37.28,8.69 arc45 36.38,9.06 23.47,9.06 arc-45 22.57,9.44 21.8,10.2 arc45 20.9,10.57 U8.11 17.68,12.74 arc45 16.78,13.11 RN2.5
  Bottom 0.254: U3.19 68.1,7.19 arc45 67.73,8.09 67.21,8.61 arc-45 66.83,9.83 66.83,15.09 arc45 66.7,15.41 arc-45 66.52,15.86 66.52,16.98 arc-45 66.7,17.43 66.96,17.69 arc45 67.15,18.14 67.15,21.16 arc45 66.78,22.06 65.94,22.9 arc-45 65.56,23.8 U6.4
D6  (via drill 0.6)
  Top 0.152: U3.20
  Top 0.254: U4.20 51.22,4.49 arc-45 52.12,4.86 69.17,4.86 arc-45 70.06,4.49 U3.20 | U8.18 30.53,10.57 arc-45 29.63,10.94 28.15,12.42 arc45 27.25,12.8 23.23,12.8 arc-45 22.33,13.17 21.49,14.01 arc45 20.59,14.38 19.42,14.38 arc-45 18.52,14.75 18.29,14.99 arc-45 18.1,15.44 arc45 17.73,16.34 17.52,16.55 arc45 16.62,16.92 15.92,16.92 arc-45 15.03,17.29 14.5,17.82 arc45 13.6,18.19 RN1.7 | v31.59,2.32 32.49,1.42 arc45 33.39,1.05 45.99,1.05 arc45 46.89,1.42 v47.62,2.16
  Bottom 0.254: v47.62,2.16 49,2.16 arc45 49.9,2.53 50.27,2.9 arc45 50.64,3.8 U4.20 | U8.18 34.34,10.57 arc45 33.44,10.2 31.96,8.72 arc45 31.59,7.82 v31.59,2.32
D7  (via drill 0.6)
  Top 0.152: U3.21
  Top 0.254: RN2.7 17.09,18.19 arc-45 17.99,17.82 18.52,17.29 arc45 19.42,16.92 21.22,16.92 arc45 22.12,17.29 arc-45 22.76,17.56 24.71,17.56 arc-45 25.61,17.19 29.31,13.48 arc45 30.21,13.11 U8.19 36.3,13.11 arc-45 37.2,12.74 39,10.94 arc45 39.9,10.57 45.83,10.57 arc-45 46.73,10.2 49.16,7.77 arc45 50.06,7.4 51.7,7.4 arc-45 52.6,7.03 U4.21 53.76,7.03 arc-45 54.66,7.4 71.7,7.4 arc-45 72.6,7.03 U3.21 73.76,7.03 arc45 74.14,7.92 74.14,22.88 arc45 74.22,23.07 74.22,28.49 arc-45 74.4,29.25 74.51,29.36 arc45 74.69,29.81 74.69,33.14 arc-45 75.06,34.04 arc45 75.41,34.87 v75.41,41.37
  Bottom 0.254: v75.41,41.37 75.03,41.37 arc45 74.59,41.18 arc-45 74.27,41.05 54.61,41.05 arc-90 U5.13
DOTCLK
  Top 0.254: U7.11 23.65,53.01 arc-45 23.28,52.11 21.49,50.31 arc45 21.11,49.42 U7.3 21.11,45.39 arc-45 20.74,44.49 20.22,43.96 arc-45 19.32,43.59 11.01,43.59 arc45 10.37,43.33 arc-45 9.47,42.96 CN1.6
EXROM  (via drill 0.6)
  Top 0.254: U5.6 57.94,34.39 57.05,33.49 arc45 56.67,32.59 56.67,29.51 arc-45 56.3,28.62 55.14,27.45 arc-45 54.24,27.08 53,27.08 arc-45 52.23,27.4 46.87,32.76 arc45 46.01,33.11 43.23,33.11 arc-45 42.33,33.49 v40.8,35.02 | CN1.9 v10,35.34
  Bottom 0.254: v10,35.34 12.65,35.34 arc-45 13.55,34.97 arc45 14.18,34.7 25.03,34.7 arc45 25.93,35.07 27.38,36.53 arc-45 28.28,36.9 32.87,36.9 arc45 33.29,37.07 arc-45 33.74,37.26 38.05,37.26 arc-45 38.95,36.88 v40.8,35.02
GAME  (via drill 0.6)
  Top 0.254: CN1.8 8.93,37.88 arc45 9.83,38.25 v12,40.42
  Bottom 0.254: U2.1 37.62,42.53 arc-45 37.25,41.63 34.5,38.88 arc-45 33.6,38.51 33.12,38.51 arc45 32.68,38.33 arc-45 32.36,38.19 14.58,38.19 arc-45 13.68,38.57 12,40.24 v12,40.42
GND  (via drill 0.6)
  Top 0.813: v8.1,55.66 CN1.1 | CN1.22 v8.1,2.32
  Bottom 0.254: 79.85,35.18 79.69,35.02 | 79.53,35.18 79.69,35.34 | 81.91,5.17 81.88,5.14 | 60.8,48.67 60.66,48.54 | 59.85,48.67 59.99,48.54
  Bottom 0.406: 81.88,5.14 S1.1 | 81.91,18.19 J1.2 80.8,18.19 | 80.8,18.19 arc90 81.76,19.14 | 80.8,18.19 arc-90 81.76,17.24 | S1.1 81.08,5.14 arc90 81.76,5.81 | S1.1 81.16,5.14 arc-90 81.76,4.54
  Bottom 0.813: v8.1,2.32 CN1.22 v8.1,2.32 | v8.1,2.32 arc-45 8.64,2.09 9.31,1.42 arc45 10.21,1.05 18.57,1.05 | 18.57,1.05 21.11,1.05 | 21.11,1.05 24.29,1.05 | 24.29,1.05 26.83,1.05 | 26.83,1.05 43.97,1.05 | 43.97,1.05 46.83,1.05 | 46.83,1.05 56.67,1.05 | 56.67,1.05 64.29,1.05 | 81.91,7.08 81.91,5.17 81.91,3 arc-45 81.54,2.1 80.86,1.42 arc-45 79.96,1.05 66.83,1.05 | v8.1,55.66 CN1.1 v8.1,55.66 | v8.1,55.66 arc-45 8.64,55.43 12.49,51.58 arc-45 12.86,50.69 12.86,50.26 | 63.02,36.55 U5.8 63.18,35.18 | 63.02,36.55 arc45 62.76,37.19 arc45 61.86,37.56 61.75,37.56 | 61.75,37.56 C5.2 | 64.29,1.05 66.83,1.05 | 81.91,7.08 81.91,18.19 81.91,22.88 | 79.85,35.18 79.53,35.18 79.11,35.18 arc-45 78.21,35.55 77.21,36.55 arc45 74.96,37.56 73.18,37.56 | 73.18,37.56 70.64,37.56 | 81.91,22.88 81.91,26.13 | 81.91,26.13 81.91,33.91 | 81.91,33.91 81.91,36.61 | 81.91,36.61 81.91,44.5 arc45 81.54,45.39 81.18,45.76 arc45 80.28,46.13 U1.7 75.72,47.19 arc45 75.35,48.09 75.14,48.3 arc45 74.24,48.67 60.8,48.67 59.85,48.67 C1.2 56.23,48.92 arc18 55.83,48.99 54.13,48.99 | 81.91,7.08 81.88,7.04 | 56.67,1.05 56.83,1.21 BR1.1 | 31.27,47.83 arc90 30.11,48.99 | 31.27,47.83 U7.7 | 32.43,48.99 arc90 31.27,47.83 | 32.43,48.99 33.29,48.99 arc-18 33.69,48.92 C2.2 34.82,48.86 arc-27 35.38,48.99 51.28,48.99 | 32.43,48.99 30.11,48.99 | 30.11,48.99 14.76,48.99 | 73.18,37.56 arc90 71.91,36.29 | 71.91,36.29 C6.2 | 70.64,37.56 arc-90 71.91,36.29 | 70.64,37.56 64.29,37.56 | 64.29,37.56 64.03,37.56 arc90 63.02,36.55 | 64.29,37.56 61.75,37.56 | 79.85,35.18 80.49,35.18 arc90 81.91,36.61 | 79.85,35.18 80.64,35.18 arc-90 81.91,33.91 | 79.53,24.54 80.33,24.54 arc90 81.91,26.13
  Bottom 0.813: 79.53,24.54 U6.8 | 79.53,24.54 80.25,24.54 arc-90 81.91,22.88 | 64.29,1.05 arc90 65.56,2.95 | 65.56,2.95 U3.16 | 66.83,1.05 arc-90 65.56,2.95 | 43.97,1.05 arc90 45.56,2.63 U4.16 45.56,2.32 arc90 46.83,1.05 | 25.56,3.91 C8.2 | 25.56,3.91 arc90 25.56,3.91 | 24.29,1.05 arc90 25.56,2.63 | 25.56,2.63 25.56,3.91 | 26.83,1.05 arc-90 25.56,2.63 | 21.11,1.05 arc-90 19.84,2.32 | 19.84,2.32 U8.14 | 18.57,1.05 arc90 19.84,2.32 | 54.13,48.99 51.28,48.99 | 54.13,48.99 arc90 52.86,47.4 | 52.86,47.4 U2.7 | 51.28,48.99 arc-90 52.86,47.4 | 12.86,50.26 C7.2 13.18,48.99 14.76,48.99 | 14.76,48.99 14.13,48.99 arc-90 12.86,50.26
I/O1  (via drill 0.6)
  Top 0.254: CN1.7 8.2,40.42 arc45 9.1,40.79 10.9,42.59 arc-45 11.8,42.96 20.01,42.96 arc45 20.91,43.33 22.01,44.44 arc45 22.38,45.33 22.38,49.42 arc-45 22.76,50.31 v24.29,51.85
  Bottom 0.254: U2.9 50.32,54.5 arc45 49.95,55.39 arc45 49.32,55.66 47.67,55.66 arc45 46.78,55.29 arc45 46.51,54.65 46.51,53.01 arc-45 46.14,52.11 arc-45 45.51,51.85 45.13,51.85 arc-45 44.24,52.22 arc-45 43.97,52.85 43.97,54.5 arc45 43.6,55.39 arc45 42.97,55.66 25.93,55.66 arc45 25.3,55.39 arc45 24.92,54.5 24.92,53.01 arc-45 24.55,52.11 v24.29,51.85
I/O2
  Top 0.254: U8.20 31.48,15.65 arc-45 30.58,16.02 24.74,21.87 arc45 23.84,22.24 19.34,22.24 arc-45 18.44,22.61 18.15,22.9 arc45 17.25,23.27 15.61,23.27 arc-45 14.71,23.64 12.6,25.76 arc-45 12.22,26.66 12.22,31.16 arc45 11.96,31.79 11.33,32.43 arc45 10.43,32.8 CN1.10
N$1
  Bottom 0.254: U2.3 U2.4
N$2
  Top 0.254: CN1.21 8.2,4.86 arc-45 9.1,4.49 10.26,3.32 arc45 11.16,2.95 RN1.1
N$3
  Top 0.254: CN1.20 8.2,7.4 arc-45 9.1,7.03 11.53,4.59 arc45 12.43,4.22 13.28,4.22 arc-45 14.18,3.85 14.71,3.32 arc45 15.61,2.95 RN2.1
N$4
  Top 0.254: CN1.19 8.2,9.94 arc45 9.1,10.31 arc-45 9.74,10.57 RN1.4
N$5
  Top 0.254: CN1.18 8.2,12.48 arc-45 9.1,12.11 arc45 9.74,11.84 13.28,11.84 arc-45 14.18,11.47 14.71,10.94 arc45 15.61,10.57 RN2.4
N$6
  Top 0.254: CN1.17 8.2,15.02 arc45 9.1,15.39 arc-45 9.74,15.65 RN1.6
N$7
  Top 0.254: CN1.16 8.2,17.56 arc-45 9.1,17.19 arc45 9.74,16.92 13.28,16.92 arc-45 14.18,16.55 14.71,16.02 arc45 15.61,15.65 RN2.6
N$8
  Top 0.254: CN1.15 8.36,20.1 arc45 8.99,20.36 arc-45 9.89,20.73 RN1.8
N$9
  Top 0.254: RN2.8 15.08,20.73 13.55,22.27 arc45 12.65,22.64 CN1.14
N$11
  Top 0.254: 68.1,44.86 U1.4 | 68.1,44.86 68.55,44.41 arc45 69,44.23 71.09,44.23 arc45 71.54,44.41 arc45 71.68,44.73 71.68,47.83 arc-45 72.05,48.73 72.81,49.49 arc45 73.18,50.39 U1.9 | U2.10 47.78,51.9 arc45 48.05,51.27 arc45 48.94,50.89 52.34,50.89 arc-45 53.24,50.52 58.92,44.84 arc45 59.82,44.47 67.18,44.47 arc45 68.08,44.84 68.1,44.86
N$14
  Top 0.254: U7.9 28.73,54.18 arc45 28.36,55.08 28.15,55.29 arc45 27.25,55.66 23.54,55.66 arc45 22.65,55.29 arc45 22.38,54.65 22.38,53.33 arc-45 22.01,52.43 18.95,49.36 arc45 18.57,48.46 U7.2
N$15
  Top 0.254: U1.5 70.64,48.78 arc45 70.27,49.68 68.48,51.48 arc-45 68.1,52.37 U1.11
N$16
  Bottom 0.254: R2.1 77.63,42.43 arc-45 78,43.33 78.53,43.86 arc-45 79.42,44.23 LED1.A | LED1.A
N$17  (via drill 0.6)
  Top 0.254: v79.22,37.88 79.22,36.55 arc-45 79.03,36.1 78.45,35.52 arc45 78.26,35.07 78.26,22.58 arc-45 78.08,22.13 arc45 77.95,21.82 J1.1
  Bottom 0.254: v79.22,37.88 78.32,38.78 arc45 77.42,39.15 47.99,39.15 arc-45 47.09,39.52 46.89,39.73 arc-45 46.51,40.63 46.51,43.7 arc-45 46.89,44.6 47.41,45.13 arc45 47.78,46.02 U2.5 47.78,47.08 47.2,47.67 arc45 46.3,48.04 37.2,48.04 arc45 35.66,47.35 arc45 35.4,46.71 35.4,42.21 arc-45 35.03,41.32 33.55,39.84 arc-45 32.65,39.47 R3.2
N$18
  Bottom 0.254: LED1.K 79.53,40.74 arc-45 78.77,40.42 52.7,40.42 arc-90 U5.14
N$21
  Top 0.254: U2.12 42.7,54.39 arc-90 43.97,55.66 53.29,55.66 arc-45 54.19,55.29 54.71,54.76 arc-45 55.09,53.86 arc45 55.39,53.13 55.67,52.85 arc45 56.56,52.48 57.1,52.48 arc-45 58,52.11 58.21,51.9 arc45 59.1,51.53 60.27,51.53 arc45 61.17,51.9 61.38,52.11 arc45 61.75,53.01 61.75,54.5 arc-45 62.13,55.39 arc-45 62.76,55.66 63.13,55.66 arc-45 64.03,55.29 arc-45 64.29,54.65 64.29,50.79 arc45 64.67,49.89 65.19,49.36 arc-45 65.56,48.46 U1.3
N$30  (via drill 0.6)
  Top 0.254: v73.5,34.86 73.5,43.33 arc45 73.31,43.78 arc-45 73.18,44.1 U1.6
  Bottom 0.152: U6.9
  Bottom 0.254: v73.5,34.86 73.77,34.86 arc-45 74.67,34.49 75.35,33.8 arc-45 75.72,32.91 U6.9
N$31
  Top 0.254: U1.8 75.72,52.06 arc-45 75.35,51.16 72.52,48.33 arc45 72.15,47.43 72.15,44.41 arc-45 71.97,43.96 71.78,43.78 arc-45 71.33,43.59 65.67,43.59 arc45 65.22,43.41 64.8,42.98 arc-45 64.35,42.8 U5.9
N$32
  Top 0.254: U5.2 47.78,36.08 arc45 47.41,36.98 46.89,37.51 arc-45 46.51,38.4 46.51,43.23 arc45 46.14,44.12 arc45 45.31,44.47 40.69,44.47 arc-45 40.47,44.56 40.26,44.77 arc-45 40.16,44.99 U2.2
N$33
  Bottom 0.254: U5.10 60.48,43.28 arc90 59.21,44.47 51.91,44.47 arc-90 U2.6
N$34
  Top 0.813: BR1.2 | BR1.2 53.18,22.16 arc-90 51.91,23.43 C4.2
  Bottom 0.61: 61.75,22.95 61.75,25.81
  Bottom 0.813: 61.75,25.81 61.75,26.56 arc-45 62.13,27.45 C3.2 | BR1.2 60.96,22.16 arc90 61.75,22.95
PHI2  (via drill 0.6)
  Top 0.254: v9.37,46.13 9.37,47.19 arc-45 9.74,48.09 12.17,50.52 arc-45 13.07,50.89 15.19,50.89 arc45 16.09,51.27 U7.13 | U1.1 60.48,47.83 arc45 60.11,48.73 57.63,51.21 arc45 56.86,51.53 v54.77,51.53
  Bottom 0.254: CN1.E 8.2,45.5 arc45 9.1,45.87 v9.37,46.13 | U7.13 18.57,54.66 arc-45 18.95,55.55 19.79,56.4 arc-45 20.69,56.77 53.29,56.77 arc-90 54.77,55.29 v54.77,51.53
PULLUP  (via drill 0.6)
  Top 0.254: U7.4 23.65,49.1 arc-45 24.03,50 25.82,51.79 arc45 26.19,52.69 | 26.19,52.69 U7.10 | R1.1 16.35,42 arc45 15.45,41.63 14.29,40.47 arc45 13.92,39.58 13.92,34.91 arc90 15.08,33.75 SJ1.1 SJ1.2 16.78,36.29 arc45 17.68,36.66 17.88,36.87 arc-45 18.78,37.24 20.59,37.24 arc-45 21.49,36.87 21.69,36.66 arc-45 22.07,35.76 22.07,34.28 arc45 22.44,33.38 24.55,31.26 arc45 25.45,30.89 v31.59,30.89 | U1.13 U1.2 | v31.91,50.26 31.91,50.37 arc45 31.54,51.27 31.33,51.48 arc45 30.43,51.85 27.56,51.85 arc-45 26.67,52.22 26.19,52.69
  Bottom 0.254: R1.1 23.28,43.86 arc45 23.65,44.75 U7.4 | v31.59,30.89 31.59,30.47 arc45 31.96,29.57 32.81,28.72 arc-45 33.18,27.83 33.18,23.78 arc45 33.31,23.46 arc45 33.76,23.27 U8.23 | U1.13 63.02,52.11 arc-45 62.84,51.66 61.62,50.45 arc-45 61.17,50.26 32.04,50.26 arc45 v31.91,50.26
R/W  (via drill 0.6)
  Top 0.254: v17.3,50.26 17.3,45.39 arc-45 16.93,44.49 arc-45 16.3,44.23 9.89,44.23 arc-45 8.99,44.6 8.47,45.13 arc45 7.57,45.5 CN1.5
  Bottom 0.254: v17.3,50.26 19.47,52.43 arc45 19.84,53.33 19.84,54.81 arc-45 20.22,55.71 20.34,55.84 arc-45 21.24,56.21 43.74,56.21 43.97,56.21 arc-90 45.24,54.94 U2.11
RESET  (via drill 0.6)
  Top 0.254: U5.1 45.24,35.02 46.46,33.8 arc45 47.36,33.43 48.47,33.43 arc45 48.92,33.62 arc45 49.05,33.94 v49.05,40.1 | v80.49,37.88 81.57,36.79 arc-45 81.76,36.34 81.76,13.96 arc-45 81.38,13.06 80.83,12.51 arc45 80.46,11.61 S1.2
  Bottom 0.254: CN1.C 8.84,50.58 arc-45 9.74,50.21 9.95,50 arc-45 10.32,49.1 10.32,39.99 arc45 10.69,39.09 11.85,37.93 arc45 12.75,37.56 32.6,37.56 arc45 33.05,37.75 arc-45 33.36,37.88 39.32,37.88 arc-45 40.22,37.51 42.17,35.55 arc45 43.07,35.18 U5.1 45.24,35.02 50.27,29.99 arc-45 50.64,29.1 50.64,23.64 arc45 50.9,23.01 arc45 51.8,22.64 53.29,22.64 arc45 54.19,23.01 55.35,24.17 arc-45 56.25,24.54 U6.1 | v49.05,40.1 49.5,40.1 arc-45 49.82,39.97 arc45 50.27,39.78 78.05,39.78 arc-45 78.95,39.41 v80.49,37.88
ROMH  (via drill 0.6)
  Top 0.254: v34.13,43.59 36.62,41.11 arc45 37.51,40.74 v37.94,40.74 | U3.22 70.75,6.45 arc-45 71.65,6.07 71.86,5.86 arc45 72.76,5.49 73.61,5.49 arc45 74.51,5.86 arc45 74.77,6.5 74.77,20.52 arc-45 75.14,21.42 76.81,23.09 arc45 76.99,23.54 76.99,24.97 arc45 76.62,25.87 76.1,26.39 arc-45 75.72,27.29 75.72,28.3 arc-45 76.1,29.2 77.1,30.2 arc45 77.47,31.1 v77.47,37.88
  Bottom 0.254: CN1.B 7.89,53.12 arc-45 8.79,52.75 10.58,50.95 arc-45 10.95,50.05 10.95,49.2 arc45 11.33,48.3 11.85,47.77 arc45 12.75,47.4 14.58,47.4 arc45 14.89,47.53 arc-45 15.98,48.04 26.57,48.04 arc-45 27.33,47.53 arc-45 27.46,47.22 27.46,45.39 arc45 27.84,44.49 28.36,43.96 arc45 29.26,43.59 v34.13,43.59 | v37.94,40.74 41.54,40.74 arc-45 42.44,40.36 43.92,38.88 arc45 44.82,38.51 76.31,38.51 arc-45 77.21,38.14 v77.47,37.88
ROML  (via drill 0.6)
  Top 0.254: U4.22 50.21,6.45 arc-45 49.32,6.82 46.57,9.57 arc45 45.67,9.94 39.58,9.94 arc-45 38.68,10.31 37.52,11.47 arc45 36.62,11.84 30.21,11.84 arc-45 29.31,12.21 28.47,13.06 arc45 27.57,13.43 25.13,13.43 arc-45 24.23,13.8 v22.38,15.65 | CN1.11 9.79,30.26 arc-45 10.69,29.89 arc-45 10.95,29.25 10.95,26.34 arc45 11.33,25.44 14.39,22.37 arc45 15.29,22 16.78,22 arc-45 17.68,21.63 17.73,21.58 arc-45 18.1,20.68 18.1,20.46 arc45 18.47,19.57 arc45 18.74,19.46 v21.43,19.46
  Bottom 0.254: v21.43,19.46 22.01,18.88 arc-45 22.38,17.98 v22.38,15.65
VCC
  Top 0.254: R1.2 32.33,42 arc-45 33.23,41.63 34.71,40.15 arc-45 35.08,39.26 U8.28 | R2.2 67.04,42.32 arc45 66.14,41.95 65.3,41.11 arc-45 64.4,40.74 57.68,40.74 arc-45 57.05,41 arc-45 56.67,41.9 56.67,44.97 arc45 56.3,45.87 53.87,48.3 arc45 52.97,48.67 36.99,48.67 | 36.99,48.67 36.35,48.67 36.04,48.36 | U8.2 U8.1 | 36.99,48.67 arc-45 36.45,48.9 36.35,48.99 | 36.99,48.67 arc45 36.45,48.45 36.35,48.36
  Top 0.61: 66.83,25.81 66.83,22.64 | 66.83,30.57 66.83,33.75
  Top 0.813: C7.1 11.33,52.22 arc-45 10.43,51.85 8.73,51.85 | 14.13,53.75 C7.1 | 14.13,53.75 U7.14 | 34.45,52.48 34.45,52.06 arc45 34.82,51.16 35.66,50.31 arc-45 36.04,49.42 36.04,48.36 36.04,44.07 arc90 37.31,42.8 | 34.45,52.48 C2.1 34.45,55.02 | C5.1 arc-45 42.61,42.8 U5.16 | 46.83,22.95 C4.1 | 46.83,22.95 46.83,22.21 arc45 47.2,21.31 47.73,20.79 arc-45 48.1,19.89 U4.32 | U6.16 | 66.83,22.64 67.73,21.74 arc-45 68.1,20.84 U3.32 | 66.83,25.81 66.83,26.56 arc-45 67.21,27.45 C3.1 66.09,28.35 arc45 65.19,27.98 64.35,27.14 arc-45 63.45,26.77 59.21,26.77 | C4.1 47.15,23.91 48.42,25.18 | 48.42,25.18 48.68,25.44 arc-45 49.58,25.81 54.56,25.81 arc45 55.46,26.18 55.72,26.45 | 55.72,26.45 56.99,27.72 | 56.99,27.72 57.57,28.3 arc45 57.94,29.2 57.94,31.21 | 57.94,31.21 U6.16 | 39.21,35.97 39.21,35.02 | 39.21,35.02 39.21,29.83 arc45 39.58,28.93 43.6,24.91 arc45 44.5,24.54 45.56,24.54 | 66.83,33.75 C6.1 | U8.28 38.26,35.97 | 38.26,35.97 39.21,35.97 | 66.83,30.57 arc-90 66.2,29.94 59.85,29.94 | 7.78,53.12 7.46,53.12 | 7.46,53.12 CN1.2 | 7.78,53.12 arc-90 8.73,52.17 8.73,51.85 | 7.14,50.58 7.78,50.58 arc90 8.73,51.53 8.73,51.85 | 7.14,50.58 CN1.3 | C5.1 arc-45 42.1,42.59 | 40.24,42.8 37.31,42.8 | 40.24,42.8 42.07,42.8 arc-90 C5.1 | 39.21,35.97 39.21,36.93 | 39.21,36.93 39.21,41.53 | 39.21,41.53 arc90 37.94,42.8 37.31,42.8 | 39.21,41.53 39.21,41.77 arc-90 40.24,42.8 | 38.26,35.97 arc90 39.21,36.93 | 38.26,35.97 arc-90 39.21,35.02 | 35.72,56.61 33.18,56.61 | 35.72,56.61 55.51,56.61 arc-45 56.41,56.24 56.62,56.03 arc-45 56.99,55.13 C1.1 U1.14 | 34.45,55.34 arc-90 35.72,56.61 | 34.45,55.02 34.45,55.34 | 34.45,55.34 arc90 33.18,56.61
  Top 0.813: 33.18,56.61 14.45,56.61 arc90 12.86,55.02 | 59.85,29.94 59.21,29.94 arc-90 57.94,31.21 | 59.85,29.94 58.9,29.94 arc90 57.94,28.99 | 59.21,26.77 57.94,26.77 arc-90 56.99,27.72 | 59.21,26.77 56.49,26.77 arc45 55.72,26.45 | 12.86,55.02 arc90 14.13,53.75 | 12.86,55.02 12.86,54.71 | 12.86,54.71 12.86,54.28 arc-45 12.49,53.38 11.27,52.17 | 35.72,53.75 arc-90 34.45,55.02 | 35.72,53.75 U2.14 | 34.45,52.48 arc-90 35.72,53.75 | 45.56,24.54 46.2,24.54 arc-90 C4.1 | 45.56,24.54 47.26,24.54 arc45 48.16,24.91 48.42,25.18 | 45.56,24.54 arc-90 46.83,23.27 46.83,22.95 | 7.14,50.58 9.16,50.58 arc45 10.06,50.95 10.64,51.53 | 11.27,52.17 10.64,51.53 | 11.27,52.17 9.65,52.17 arc-45 8.76,52.54 8.41,52.88 | 10.64,51.53 9.89,51.53 arc45 8.99,51.16 8.73,50.89 | C7.1 11.96,52.85 arc-45 11.06,52.48 | 11.06,52.48 8.73,52.48 | 11.06,52.48 7.78,53.12 | 8.73,53.12 11.7,53.12 arc45 12.6,53.49 C7.1 | 8.73,53.12 7.46,53.12 | 12.86,54.71 11.64,53.49 arc-45 10.74,53.12 8.73,53.12
  Bottom 0.254: U8.26 35.73,30.89 arc-45 36.62,30.52 arc-45 36.96,29.7 36.96,26.87 arc-45 36.59,25.97 36.32,25.7 | 36.32,25.7 35.2,25.7 U8.24 U8.25 | R1.2 29.42,39.84 arc-45 28.52,39.47 R3.1 | 28.42,33.43 U8.2 | 36.32,25.7 36.62,25.41 arc-45 36.99,24.51 36.99,23.16 arc-45 36.62,22.27 arc-45 35.98,22 34.34,22 arc45 33.44,21.63 arc45 33.18,21 33.18,19.35 arc45 33.55,18.46 arc45 34.19,18.19 U8.21
  Bottom 0.813: U8.26 33.9,30.89 arc-45 33,31.26 arc-45 32.8,31.74 32.8,34.46 arc-45 33.17,35.35 | 33.17,35.35 33.39,35.57 arc-45 34.29,35.94 35.05,35.94 U8.28 | C8.1 25.56,17.03 arc-45 25.93,17.93 28.04,20.04 arc45 28.42,20.94 28.42,33.43 arc-90 29.44,34.46 | 29.44,34.46 arc27 33.17,35.35 | 29.44,34.46 31.52,34.46 arc-90 32.78,33.19
(copper drawn outside any net)
  shapes: Bottom area x871, Top area x872

### Text on the board
Bottom: REV B | VER 1.4.1
tPlace: http://skoe.de/easyflash | B | A | RAM SELECT | SJ1: A = 6264/62256 | SJ1: B = 6116